# Altium project LiOnCharger.PrjPcb (part 3 of 3)
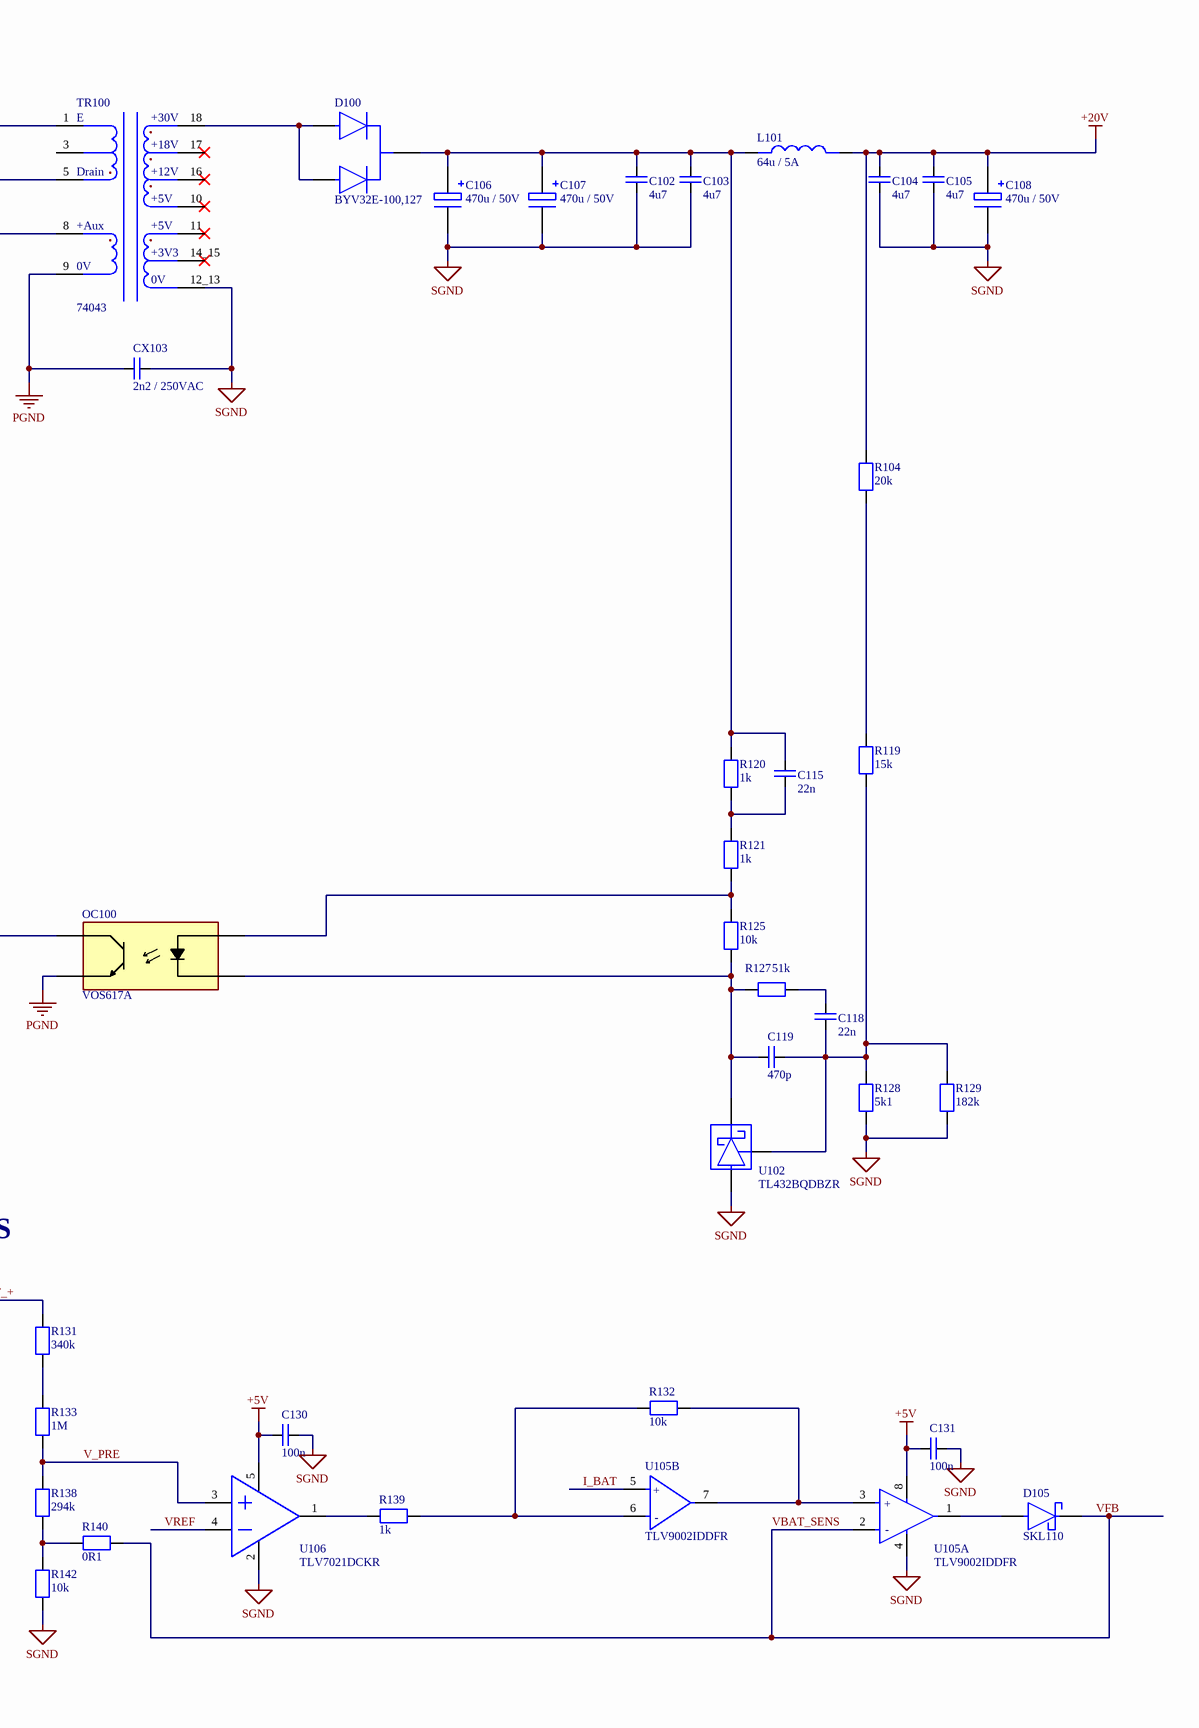
[diagram p3: SMPS.SchDoc, right]

## Sheet SMPS.SchDoc: LiOn Drill Charger (continued)

### Library data of the parts (continued)
R142 = RC0805JR-0710KL: Res Thick Film 0805 10K Ohm 5% 1/8W ±100ppm/°C Molded SMD Paper T/R; Manufacturer: Yageo; Value: 10kR; Power Rating: 125mW; Voltage Rating: 150V; Supplier: Arrow Electronics; Supplier Part Number: RC0805JR-0710KL; Manufacturer Part Number: RC0805JR-0710KL; RoHS: Yes; Category: Chip SMD Resistors; Stock: 475000; Pricing: 5000=0,0039, 10000=0,003, 25000=0,0028, 50000=0,0029, 125000=0,0023 (USD); Case/Package: 0805; Contact Plating: Tin,Matte; Case Code (Imperial): 0805; Case Code (Metric): 2012; Min Operating Temperature: -55°C; Max Operating Temperature: 155°C; Resistor Type: Thick Film; Tolerance: 5%; Temperature Coefficient: 100ppm/°C; Packaging: Tape and Reel; Termination: SMD/SMT; Features: Moisture Resistant; Series: RC; Max Power Dissipation: 125mW; Number of Terminations: 2; Resistance Tolerance: 5%; Construction: Rectangular; Length: 2mm; Width: 1.25mm; Height: 0.5mm; Depth: 1.25mm; Radiation Hardening: No; RoHS Compliant: Yes; Military Standard: Not; Lead Free: Lead Free; Reach SVHC Compliant: Unknown; ComponentLink1URL: https://datasheet.ciiva.com/7983/444164-7983765.pdf?src-supplier=Element14; ComponentLink1Description: https://datasheet.ciiva.com/7983/444164-7983765.pdf?src-supplier=Element14; ComponentLink2URL: https://datasheet.ciiva.com/7941/444164-7941870.pdf?src-supplier=Element14; ComponentLink2Description: https://datasheet.ciiva.com/7941/444164-7941870.pdf?src-supplier=Element14; ComponentLink3URL: https://datasheet.ciiva.com/7941/444164-7941871.pdf?src-supplier=Element14; ComponentLink3Description: https://datasheet.ciiva.com/7941/444164-7941871.pdf?src-supplier=Element14
TR100 = 74043_MYRRA: Transformator: impulsowy; 85VAC,265VAC; 3,3V; 5V; 7A; 7A; PCB; 60W; Manufacturer Part Number: 74043
U100 = ICE2QS03G: AC/DC Converters Quasi-Resonant PWM Controller; Manufacturer: Infineon; Switching Frequency: 52kHz; Topology: Flyback; Duty Cycle: 50%; Fault Protection: Over Voltage,Over Temperature; Supplier: Mouser; Supplier Part Number: 726-ICE2QS03GXUMA1; Manufacturer Part Number: ICE2QS03G; RoHS: Yes; Category: Uncategorized; Stock: 2920; Pricing: 1=1,91, 10=1,72, 50=1,62, 100=1,38, 1000=1,1, 10000=0,928 (USD); Case/Package: SOIC; Pins: 8; Min Operating Temperature: -25°C; Max Operating Temperature: 150°C; Series: -; Packaging: Tape and Reel; Package Quantity: 2500; Frequency: 52kHz; RoHS Compliant: Yes; Reach SVHC Compliant: Yes; ComponentLink1URL: https://datasheet.ciiva.com/9214/infineon-ice2qs03g-ds-v02-03-en-9214144.pdf?src-supplier=Avnet; ComponentLink1Description: https://datasheet.ciiva.com/9214/infineon-ice2qs03g-ds-v02-03-en-9214144.pdf?src-supplier=Avnet; ComponentLink2URL: https://datasheet.ciiva.com/1931/infineon-ice2qs03g-ds-v02-03-en-1931271.pdf?src-supplier=Digi-Key; ComponentLink2Description: https://datasheet.ciiva.com/1931/infineon-ice2qs03g-ds-v02-03-en-1931271.pdf?src-supplier=Digi-Key
U101 = ATL432BQDBZR: V-Ref Adjustable 2.5V to 36V 100mA Automotive 3-Pin SOT-23 T/R; Manufacturer: Texas Instruments; Temperature Coefficient: 82ppm/°C; Cathode Current: 35uA; Tolerance: 0.5%; Reference Type: Shunt; Supplier: Mouser; Supplier Part Number: 595-ATL432BQDBZR; Manufacturer Part Number: ATL432BQDBZR; RoHS: Yes; Category: Voltage References; Stock: 18510; Pricing: 1=0,82, 10=0,721, 50=0,677, 100=0,553, 1000=0,35, 10000=0,316 (USD); Mounting Technology: Surface Mount; Case/Package: TO-236-3; Pins: 3; Min Operating Temperature: -40°C; Max Operating Temperature: 125°C; Packaging: Cut Tape; Min Output Voltage: 2.5V; Max Output Voltage: 36V; Output Current: 100mA; Output Voltage: 36V; Max Output current: 100mA; Output Type: Adjustable; Series: -; Lead Free: Lead Free; RoHS Compliant: Yes; ComponentLink1URL: http://www.ti.com/lit/ds/symlink/atl432a.pdf?src-supplier=Digi-Key; ComponentLink1Description: http://www.ti.com/lit/ds/symlink/atl432a.pdf?src-supplier=Digi-Key; ComponentLink2URL: http://www.ti.com/general/docs/lit/getliterature.tsp?genericPartNumber=ATL432&&fileType=pdf&src-supplier=Avnet; ComponentLink2Description: http://www.ti.com/general/docs/lit/getliterature.tsp?genericPartNumber=ATL432&&fileType=pdf&src-supplier=Avnet
U102 U107 = TL432BQDBZR: IC VREF SHUNT ADJ SOT23-3; Manufacturer: Texas Instruments; Max Supply Voltage: 37V; Output Voltage: 36V; Tolerance: 0.5%; Max Output current: 100mA; Temperature Coefficient: 92ppm/°C; Cathode Current: 700uA; Reference Type: Shunt,Adjustable; Number of Channels: 1; Min Input Voltage: 2.495V; Supplier: Mouser; Supplier Part Number: 595-TL432BQDBZR; Manufacturer Part Number: TL432BQDBZR; RoHS: Yes; Category: Voltage References; Stock: 26990; Pricing: 1=0,51, 10=0,438, 50=0,438, 100=0,304, 1000=0,199, 10000=0,159 (USD); Case/Package: SOT-23-3; Pins: 3; Min Operating Temperature: -40°C; Max Operating Temperature: 125°C; Packaging: Tape and Reel; Package Quantity: 1; Output Current: 100mA; Series: -; Reference Voltage: 36V; Radiation Hardening: No; Lead Free: Lead Free; RoHS Compliant: Yes; Reach SVHC Compliant: No; ComponentLink1URL: https://datasheet.ciiva.com/2006/tl431a-2006846.pdf?src-supplier=Digi-Key; ComponentLink1Description: https://datasheet.ciiva.com/2006/tl431a-2006846.pdf?src-supplier=Digi-Key; ComponentLink2URL: https://datasheet.ciiva.com/2006/tl431a-2006845.pdf?src-supplier=Digi-Key; ComponentLink2Description: https://datasheet.ciiva.com/2006/tl431a-2006845.pdf?src-supplier=Digi-Key; ComponentLink3URL: https://datasheet.ciiva.com/2006/tl431a-2006847.pdf?src-supplier=Digi-Key; ComponentLink3Description: https://datasheet.ciiva.com/2006/tl431a-2006847.pdf?src-supplier=Digi-Key; ComponentLink4URL: https://datasheet.ciiva.com/14366/tl432b-14366078.pdf?src-supplier=Avnet; ComponentLink4Description: https://datasheet.ciiva.com/14366/tl432b-14366078.pdf?src-supplier=Avnet; ComponentLink5URL: https://datasheet.ciiva.com/3235/tl432b-3235641.pdf?src-supplier=Avnet; ComponentLink5Description: https://datasheet.ciiva.com/3235/tl432b-3235641.pdf?src-supplier=Avnet
U103 = L7805C-V: L7805 Series 5 V 1.5 A Fixed Flange Mount Voltage Regulator - TO-220-3; Manufacturer: STMicroelectronics; Output Voltage: 5V; Number of Outputs: 1; Max Supply Voltage: 35V; Max Output current: 1.5A; Polarity: Positive; Quiescent Current: 8mA; Dropout Voltage: 2V; Min Input Voltage: 7V; Tolerance: 5%; Power Supply Rejection Ratio (PSRR): 62dB; Supplier: Mouser; Supplier Part Number: 511-L7805CV; Manufacturer Part Number: L7805C-V; RoHS: Yes; Category: Voltage Regulators - Linear; Stock: 96262; Pricing: 1=0,69, 10=0,569, 50=0,569, 100=0,464, 1000=0,294, 10000=0,246 (USD); Mounting Technology: Through Hole; Case/Package: TO; Pins: 3; Weight: 0.08113oz; Min Operating Temperature: 0°C; Max Operating Temperature: 125°C; Packaging: Rail/Tube; Output Type: Fixed; Output Current: 1.5A; Number of Regulators: 1; Output Configuration: Positive; Series: -; Package Quantity: 1000; Nominal Output Voltage: 5V; Min Output Voltage: 5V; Length: 10.4mm; Width: 4.6mm; Height: 9.15mm; Radiation Hardening: No; Lead Free: Lead Free; Reach SVHC Compliant: No; RoHS Compliant: Yes; ComponentLink1URL: https://datasheet.ciiva.com/19480/924633-19480531.pdf?src-supplier=Jameco; ComponentLink1Description: https://datasheet.ciiva.com/19480/924633-19480531.pdf?src-supplier=Jameco; ComponentLink2URL: https://datasheet.ciiva.com/15111/getdatasheetpartid-44136-15111027.pdf?src-supplier=Verical; ComponentLink2Description: https://datasheet.ciiva.com/15111/getdatasheetpartid-44136-15111027.pdf?src-supplier=Verical; ComponentLink3URL: https://datasheet.ciiva.com/29156/156048-da-01-en-spannungsregler-l-7805-cv-to220-stm-29156924.pdf?src-supplier=Conrad; ComponentLink3Description: https://datasheet.ciiva.com/29156/156048-da-01-en-spannungsregler-l-7805-cv-to220-stm-29156924.pdf?src-supplier=Conrad; ComponentLink4URL: https://datasheet.ciiva.com/1512/1805459-1512333.pdf?src-supplier=Element14; ComponentLink4Description: https://datasheet.ciiva.com/1512/1805459-1512333.pdf?src-supplier=Element14; ComponentLink5URL: https://datasheet.ciiva.com/1511/1805459-1511914.pdf?src-supplier=Element14; ComponentLink5Description: https://datasheet.ciiva.com/1511/1805459-1511914.pdf?src-supplier=Element14; ComponentLink6URL: https://datasheet.ciiva.com/14149/tel78xx-l78xxc-e-14149770.pdf?src-supplier=Distrelec; ComponentLink6Description: https://datasheet.ciiva.com/14149/tel78xx-l78xxc-e-14149770.pdf?src-supplier=Distrelec; ComponentLink7URL: https://datasheet.ciiva.com/2043/cd00000444-2043986.pdf?src-supplier=Digi-Key; ComponentLink7Description: https://datasheet.ciiva.com/2043/cd00000444-2043986.pdf?src-supplier=Digi-Key; ComponentLink8URL: https://datasheet.ciiva.com/6884/1805459-6884463.pdf?src-supplier=Newark; ComponentLink8Description: https://datasheet.ciiva.com/6884/1805459-6884463.pdf?src-supplier=Newark; ComponentLink9URL: https://datasheet.ciiva.com/1511/1805459-1511915.pdf?src-supplier=Element14; ComponentLink9Description: https://datasheet.ciiva.com/1511/1805459-1511915.pdf?src-supplier=Element14; ComponentLink10URL: https://datasheet.ciiva.com/2073/cd00000444-2073087.pdf?src-supplier=Digi-Key; ComponentLink10Description: https://datasheet.ciiva.com/2073/cd00000444-2073087.pdf?src-supplier=Digi-Key; ComponentLink11URL: https://datasheet.ciiva.com/16458/cd00000444-16458159.pdf?src-supplier=Future+Electronics; ComponentLink11Description: https://datasheet.ciiva.com/16458/cd00000444-16458159.pdf?src-supplier=Future+Electronics
U104 = TPS92200D2DDCR: 4-V to 30-V input voltage, 1.5-A output current, synchronous buck LED driver with dimming options 6-SOT-23-THIN; Manufacturer: Texas Instruments; Supplier: Mouser; Supplier Part Number: 595-TPS92200D2DDCR; Manufacturer Part Number: TPS92200D2DDCR; RoHS: Yes; Category: LED Drivers; Stock: 356; Pricing: 1=1,25, 10=1,13, 50=1,07, 100=0,878, 1000=0,573, 10000=0,521 (USD)
U105 = TLV9002IDDFR: 2-channel, 1-MHz, RRIO, 1.8-V to 5.5-V operational amplifier 8-SOT-23-THIN -40 to 125; Manufacturer: Texas Instruments; Supplier: Mouser; Supplier Part Number: 595-TLV9002IDDFR; Manufacturer Part Number: TLV9002IDDFR; RoHS: Yes; Category: Amplifiers - Op Amps, Buffer, Instrumentation; Stock: 20725; Pricing: 1=0,54, 10=0,433, 50=0,433, 100=0,322, 1000=0,211, 10000=0,171 (USD)
U106 = TLV7021DCKR: Low power, small size comparator with open-drain output 5-SC70 -40 to 125; Manufacturer: Texas Instruments; Number of Channels: 1; Input Bias Current: 5pA; Quiescent Current: 10uA; Common Mode Rejection Ratio: 78dB; Propagation Delay: 350ns; Hysteresis: 4.2mV; Supplier: Mouser; Supplier Part Number: 595-TLV7021DCKR; Manufacturer Part Number: TLV7021DCKR; RoHS: Yes; Category: Amplifiers - Op Amps, Buffer, Instrumentation; Stock: 8671; Pricing: 1=0,66, 10=0,565, 50=0,565, 100=0,392, 1000=0,256, 10000=0,205 (USD); Mounting Technology: Surface Mount; Min Operating Temperature: -40°C; Max Operating Temperature: 125°C; Packaging: Cut Tape; Number of Elements: 1; Max Input Current: 5pA; Power Supply Rejection Ratio (PSRR): 78dB; Series: -; RoHS Compliant: Yes; ComponentLink1URL: http://www.ti.com/lit/ds/symlink/tlv7011.pdf?src-supplier=Digi-Key; ComponentLink1Description: http://www.ti.com/lit/ds/symlink/tlv7011.pdf?src-supplier=Digi-Key; ComponentLink2URL: http://www.ti.com/general/docs/suppproductinfo.tsp?distId=10&amp;gotoUrl=http%3A%2F%2Fwww.ti.com%2Flit%2Fgpn%2Ftlv7011&src-supplier=Digi-Key; ComponentLink2Description: http://www.ti.com/general/docs/suppproductinfo.tsp?distId=10&amp;gotoUrl=http%3A%2F%2Fwww.ti.com%2Flit%2Fgpn%2Ftlv7011&src-supplier=Digi-Key
VR100 = B72205S0271K101: Var MOV 275VAC/350VDC 400A 430V Thru-Hole Radial Bulk / VARISTOR 430V 400A DISC 5MM; Manufacturer: TDK EPCOS; Energy: 8.6J; Value: 50pF; Max Voltage Rating (AC): 275V; Max Voltage Rating (DC): 350V; Clamping Voltage: 710V; Clamping Current: 5A; Number of Circuits: 1; Tolerance: 10%; Min Varistor Voltage: 387V; Max Varistor Voltage: 473V; Lead Length: 30mm; Supplier: Arrow Electronics; Supplier Part Number: B72205S0271K101; Manufacturer Part Number: B72205S0271K101; RoHS: Yes; Category: Varistors; Stock: 5; Pricing: 1=0,355, 10=0,2743, 25=0,258, 50=0,2556, 100=0,1703, 500=0,125, 1000=0,0949, 2500=0,08 (USD); Mounting Technology: Through Hole,Radial; Weight: 0.017637oz; Min Operating Temperature: -40°C; Max Operating Temperature: 85°C; Varistor Voltage: 430V; Max Surge Current: 400A; Packaging: Bulk; Lead/Base Style: Radial; Series: Standard; Voltage Rating (DC): 350V; Voltage Rating (AC): 275V; Package Quantity: 1000; Diameter: 5mm; Length: 8.5mm; Lead Pitch: 5mm; Depth: 4.3mm; Thickness: 4.3mm; Reach SVHC Compliant: No; RoHS Compliant: Yes; ComponentLink1URL: https://datasheet.ciiva.com/11834/0900766b80188ddb-11834380.pdf?src-supplier=Rs; ComponentLink1Description: https://datasheet.ciiva.com/11834/0900766b80188ddb-11834380.pdf?src-supplier=Rs; ComponentLink2URL: https://datasheet.ciiva.com/1277/1640466-1277720.pdf?src-supplier=Element14; ComponentLink2Description: https://datasheet.ciiva.com/1277/1640466-1277720.pdf?src-supplier=Element14; ComponentLink3URL: https://datasheet.ciiva.com/15155/getdatasheetpartid-382488-15155884.pdf?src-supplier=Verical; ComponentLink3Description: https://datasheet.ciiva.com/15155/getdatasheetpartid-382488-15155884.pdf?src-supplier=Verical

## Assembly variants
V1I1: all parts fitted